# Altium schematic sheet RS485.SchDoc
size A4
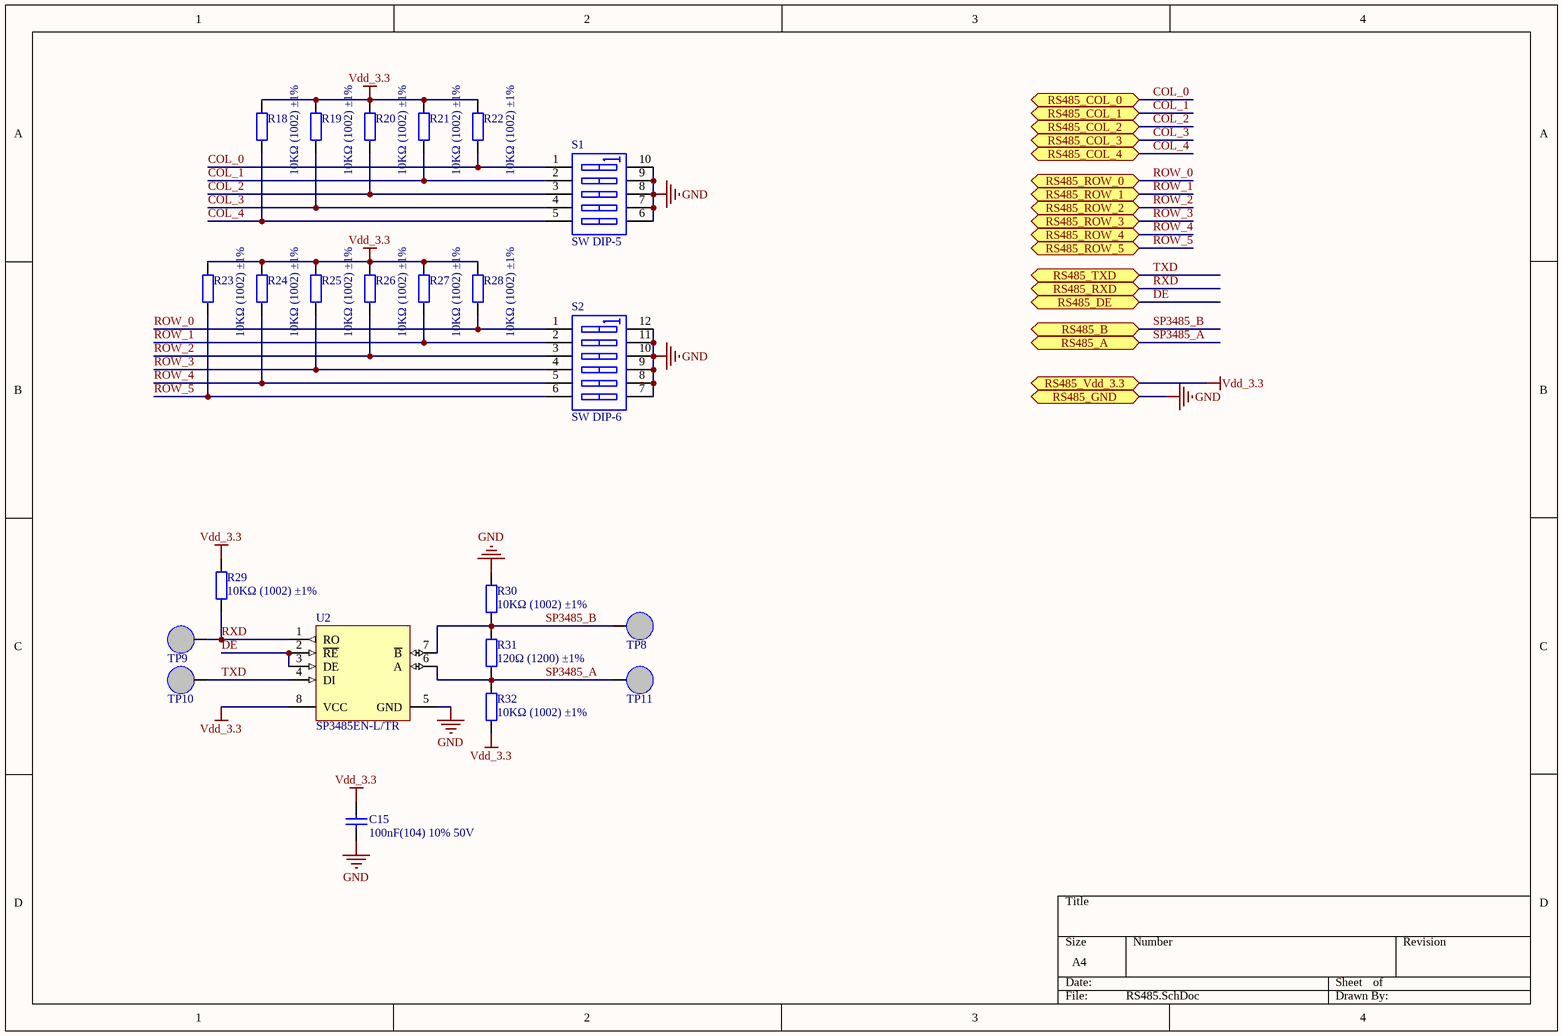
[diagram p0: RS485.SchDoc]

## Parts
C15  100nF(104) 10% 50V  [0805_C]
R18  10KΩ (1002) ±1%  [0805_R]
R19  10KΩ (1002) ±1%  [0805_R]
R20  10KΩ (1002) ±1%  [0805_R]
R21  10KΩ (1002) ±1%  [0805_R]
R22  10KΩ (1002) ±1%  [0805_R]
R23  10KΩ (1002) ±1%  [0805_R]
R24  10KΩ (1002) ±1%  [0805_R]
R25  10KΩ (1002) ±1%  [0805_R]
R26  10KΩ (1002) ±1%  [0805_R]
R27  10KΩ (1002) ±1%  [0805_R]
R28  10KΩ (1002) ±1%  [0805_R]
R29  10KΩ (1002) ±1%  [0805_R]
R30  10KΩ (1002) ±1%  [0805_R]
R31  120Ω (1200) ±1%  [0805_R]
R32  10KΩ (1002) ±1%  [0805_R]
S1  SW DIP-5  [N10A]
S2  SW DIP-6  [DIP-12/SW]
TP8  TP  [TP]  (value not drawn)
TP9  TP  [TP]  (value not drawn)
TP10  TP  [TP]  (value not drawn)
TP11  TP  [TP]  (value not drawn)
U2  SP3485EN-L/TR  [SOIC-8_150mil]

## Ports
RS485_A, RS485_B, RS485_COL_0, RS485_COL_1, RS485_COL_2, RS485_COL_3, RS485_COL_4, RS485_DE, RS485_GND, RS485_ROW_0, RS485_ROW_1, RS485_ROW_2, RS485_ROW_3, RS485_ROW_4, RS485_ROW_5, RS485_RXD, RS485_TXD, RS485_Vdd_3.3

## Nets
GND: C15.2 R30.2 S1.6(B5) S1.7(B4) S1.8(B3) S1.9(B2) S1.10(B1) S2.7(B6) S2.8(B5) S2.9(B4) S2.10(B3) S2.11(B2) S2.12(B1) U2.5(GND) ; port RS485_GND
Vdd_3.3: C15.1 R18.2 R19.2 R20.2 R21.2 R22.2 R23.2 R24.2 R25.2 R26.2 R27.2 R28.2 R29.2 R32.1 U2.8(VCC) ; port RS485_Vdd_3.3
COL_0: R22.1 S1.1(A1) ; port RS485_COL_0
COL_1: R21.1 S1.2(A2) ; port RS485_COL_1
COL_2: R20.1 S1.3(A3) ; port RS485_COL_2
COL_3: R19.1 S1.4(A4) ; port RS485_COL_3
COL_4: R18.1 S1.5(A5) ; port RS485_COL_4
DE: U2.2(~{RE}) U2.3(DE) ; port RS485_DE
ROW_0: R28.1 S2.1(A1) ; port RS485_ROW_0
ROW_1: R27.1 S2.2(A2) ; port RS485_ROW_1
ROW_2: R26.1 S2.3(A3) ; port RS485_ROW_2
ROW_3: R25.1 S2.4(A4) ; port RS485_ROW_3
ROW_4: R24.1 S2.5(A5) ; port RS485_ROW_4
ROW_5: R23.1 S2.6(A6) ; port RS485_ROW_5
RXD: R29.1 TP9.1 U2.1(RO) ; port RS485_RXD
SP3485_A: R31.1 R32.2 TP11.1 U2.6(A) ; port RS485_A
SP3485_B: R30.1 R31.2 TP8.1 U2.7(~{B}) ; port RS485_B
TXD: TP10.1 U2.4(DI) ; port RS485_TXD

## Library data of the parts
C15 = 0805 100nF(104) 10% 50V: 贴片电容; ComponentLink1Description: 供应商链接; ComponentLink1URL: http://www.szlcsc.com/product/details_50686.html; Package: 0805; Supplier: LC; SuppliersPartNumber: C49678
R18-R30 R32 = 0805 10KΩ (1002) 1%: 贴片电阻; ComponentLink1Description: 供应商链接; ComponentLink1URL: http://www.szlcsc.com/product/details_18102.html; Package: 0805; Supplier: LC; SuppliersPartNumber: C17414
R31 = 0805 120Ω (1200) 1%: 贴片电阻; ComponentLink1Description: 供应商链接; ComponentLink1URL: http://www.szlcsc.com/product/details_18125.html; Package: 0805; Supplier: LC; SuppliersPartNumber: C17437
S1 = SW DIP-5: DIP Switch, 5 Position, SPST; Published: 24-Mar-1999; LatestRevisionDate: 17-Jul-2002; LatestRevisionNote: Re-released for DXP Platform.; PackageReference: N10A; Publisher: Altium Limited
S2 = SW DIP-6: DIP Switch, 6 Position, SPST; Published: 24-Mar-1999; LatestRevisionDate: 17-Jul-2002; LatestRevisionNote: Re-released for DXP Platform.; PackageReference: DIP-12/SW; Publisher: Altium Limited; PackageDescription: DIP Switch; 12 Leads
U2 = SP3485EN-L/TR_[C8963]: RS-485/RS-422; ComponentLink1Description: 供应商链接; ComponentLink1URL: http://www.szlcsc.com/product/details_9482.html; Package: SOIC-8; Supplier: LC; SuppliersPartNumber: C8963